# EAGLE design vela (EAGLE 7.1.0)
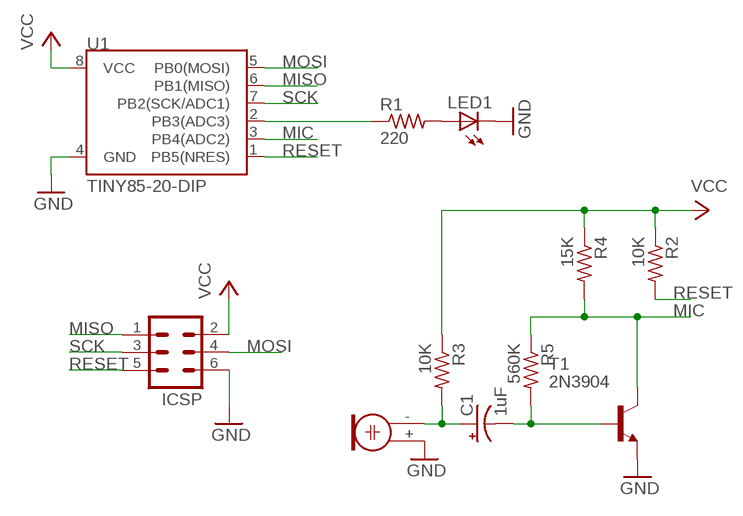
[diagram p0: schematic, sheet 1]

## Parts
C1  1uF  CPOL-USE2-5  [E2-5]
ICSP  MA03-2  [MA03-2]
LED1  LED5MM  [LED5MM]
M1  ELECTRET_MICROPHON-TOM-1545P-R  [TOM-1545P-R]
R1  220  R-US_0207/2V  [0207/2V]
R2  10K  R-US_0207/2V  [0207/2V]
R3  10K  R-US_0207/2V  [0207/2V]
R4  15K  R-US_0207/2V  [0207/2V]
R5  560K  R-US_0207/2V  [0207/2V]
T1  2N3904  [TO92]
U1  TINY85-20-DIP  ATTINY45TINY85-20-DIP  [DIP08]

## Nets
GND: ICSP.6 LED1.K(C) M1.+ T1.3(E) U1.4(GND)
MIC: R4.2 R5.1 T1.1(C) U1.3(PB4(ADC2))
MISO: ICSP.1 U1.6(PB1(MISO))
MOSI: ICSP.4 U1.5(PB0(MOSI))
N$1: LED1.A R1.2
N$2: C1.+ M1.- R3.2
N$3: C1.- R5.2 T1.2(B)
N$4: R1.1 U1.2(PB3(ADC3))
RESET: ICSP.5 R2.2 U1.1(PB5(NRES))
SCK: ICSP.3 U1.7(PB2(SCK/ADC1))
VCC: ICSP.2 R2.1 R3.1 R4.1 U1.8(VCC)

## Library data of the parts
C1 = rcl:CPOL-US: POLARIZED CAPACITOR, American symbol
ICSP = con-lstb:MA03-2: PIN HEADER; OC_FARNELL: unknown; OC_NEWARK: unknown
LED1 = led:LED: LED OSRAM: - CHIPLED LG R971, LG N971, LY N971, LG Q971, LY Q971, LO R971, LY R971 LH N974, LH R974 LS Q976, LO Q976, LY Q976 LO Q996 - Hyper CHIPLED LW Q18S LB Q993, LB Q99A, LB R99A - SideLED LS A670, LO A670, LY A670, LG A670, LP A670 LB A673, LV A673, LT A673, LW A673 LH A674 LY A675 LS A676, LA A676, LO A676, LY A676, LW A676 LS A679, LY A679, LG A679 - Hyper Micro SIDELED® LS Y876, LA Y876, LO Y876, LY Y876 LT Y87S - SmartLED LW L88C, LW L88S LB L89C, LB L89S, LG L890 LS L89K, LO L89K, LY L89K LS L896, LA L896, LO L896, LY L896 - TOPLED LS T670, LO T670, LY T670, LG T670, LP T670 LSG T670, LSP T670, LSY T670, LOP T670, LYG T670 LG T671, LOG T671, LSG T671 LB T673, LV T673, LT T673, LW T673 LH T674 LS T676, LA T676, LO T676, LY T676, LB T676, LH T676, LSB T676, LW T676 LB T67C, LV T67C, LT T67C, LS T67K, LO T67K, LY T67K, LW E67C LS E67B, LA E67B, LO E67B, LY E67B, LB E67C, LV E67C, LT E67C LW T67C LS T679, LY T679, LG T679 LS T770, LO T770, LY T770, LG T770, LP T770 LB T773, LV T773, LT T773, LW T773 LH T774 LS E675, LA E675, LY E675, LS T675 LS T776, LA T776, LO T776, LY T776, LB T776 LHGB T686 LT T68C, LB T68C - Hyper Mini TOPLED® LB M676 - Mini TOPLED Santana® LG M470 LS M47K, LO M47K, LY M47K Source: http://www.osram.convergy.de LUXEON: - LUMILED® LXK2-PW12-R00, LXK2-PW12-S00, LXK2-PW14-U00, LXK2-PW14-V00 LXK2-PM12-R00, LXK2-PM12-S00, LXK2-PM14-U00 LXK2-PE12-Q00, LXK2-PE12-R00, LXK2-PE12-S00, LXK2-PE14-T00, LXK2-PE14-U00 LXK2-PB12-K00, LXK2-PB12-L00, LXK2-PB12-M00, LXK2-PB14-N00, LXK2-PB14-P00, LXK2-PB14-Q00 LXK2-PR12-L00, LXK2-PR12-M00, LXK2-PR14-Q00, LXK2-PR14-R00 LXK2-PD12-Q00, LXK2-PD12-R00, LXK2-PD12-S00 LXK2-PH12-R00, LXK2-PH12-S00 LXK2-PL12-P00, LXK2-PL12-Q00, LXK2-PL12-R00 Source: www.luxeon.com KINGBRIGHT: KA-3528ASYC Source: www.kingbright.com
M1 = microphon:ELECTRET_MICROPHON-: Electret Condenser Microphone
R1-R5 = rcl:R-US_: RESISTOR, American symbol
T1 = transistor:2N3904: NPN TRANSISTOR
U1 = SparkFun-DigitalIC:ATTINY45: Atmel 8-pin 2/4/8kB flash uC; PROD_ID: IC-09445

## Board
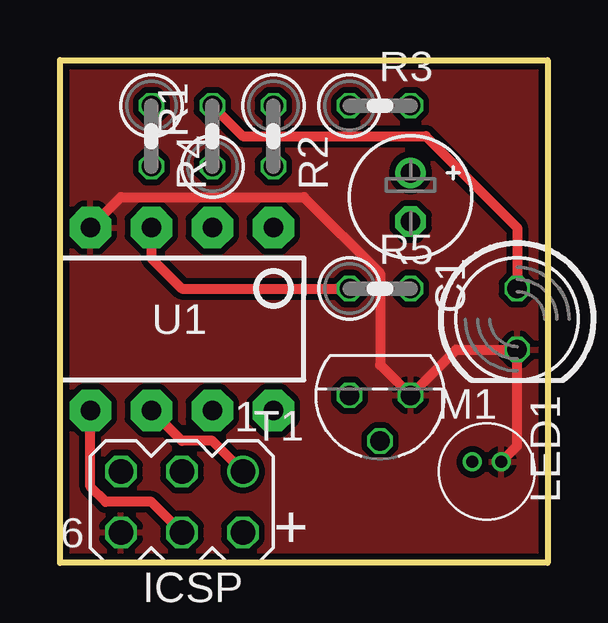
[diagram p1: board, top side]
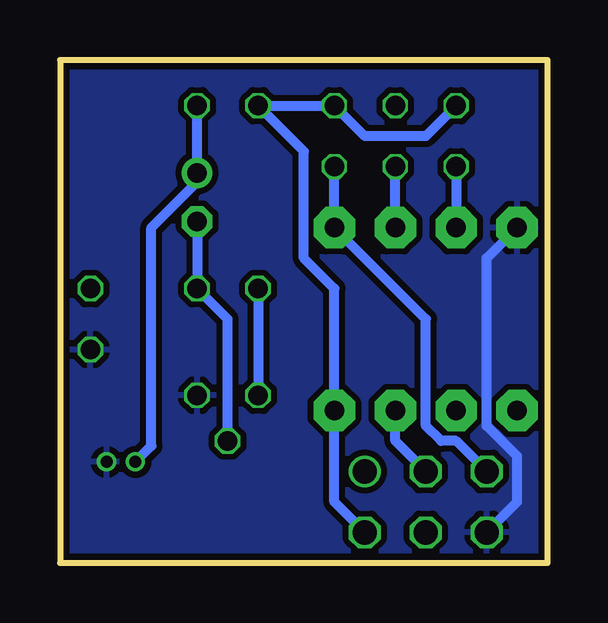
[diagram p2: board, bottom side, seen from below]

Size 20.32 x 20.95 mm. Coordinates in mm from the lower left corner, seen from the top.
Outline: 0,0 0,20.95 20.32,20.95 20.32,0 0,0
Copper layers (1*16): Top 0.035mm / dielectric 1.5mm / Bottom 0.035mm
Design rules "SparkFun *": minimum track width 8mil, minimum drill 20mil, track to track 8mil, track to pad 8mil, pad to pad 8mil, via to via 8mil, smd to smd 8mil, copper to edge 8mil, drill to drill 8mil, minimum pad ring 0mil, minimum via ring 10mil, stop-mask expansion 4mil, vias tented up to drill 20mil, thermal gap 10mil

### Footprints (pad centres in the part's own frame; a part is rotated, then mirrored left to right if it is on the bottom)
E2-5 = drill 0.813 pad 1.27: + -1.016,0 | drill 0.813 pad 1.27 octagon: - 1.016,0
MA03-2 = drill 1.016: 1 -2.54,-1.27 | drill 1.016 octagon: 2 -2.54,1.27; 3 0,-1.27; 4 0,1.27; 5 2.54,-1.27; 6 2.54,1.27
LED5MM = drill 0.813 octagon: A -1.27,0; K 1.27,0
TOM-1545P-R = drill 0.5 pad 0.8: + 0.6,0.4; - -0.6,0.4
0207/2V = drill 0.813 octagon: 1 -1.27,0; 2 1.27,0
TO92 = drill 0.813 octagon: 1 1.27,0; 2 0,1.905; 3 -1.27,0
DIP08 = drill 0.813 pad 1.727 octagon: 1 -3.81,-3.81; 2 -1.27,-3.81; 3 1.27,-3.81; 4 3.81,-3.81; 5 3.81,3.81; 6 1.27,3.81; 7 -1.27,3.81; 8 -3.81,3.81

### Placement (x,y rotation side)
C1  14.61,15.24 270 top
ICSP  5.08,2.54 180 top
LED1  19.05,10.16 270 top
M1  17.78,3.81 0 top
R1  6.35,17.78 90 top
R2  8.89,17.78 270 top
R3  13.34,19.05 0 top
R4  3.81,17.78 270 top
R5  13.34,11.43 0 top
T1  13.34,6.98 180 top
U1  5.08,10.16 180 top

### Tracks (layer width: path | path; a pad name or v marks a point on that pad's centre or on a via)
GND
  Top 0.406: M1.+ 19.05,4.88 LED1.K 16.51,8.89 T1.3 13.34,8.26 13.34,12.06 10.16,15.24 2.54,15.24 U1.4
  Bottom 0.406: ICSP.6 1.27,2.54 1.27,4.44 2.54,5.71 2.54,12.7 U1.4
  pour Bottom (isolate 0.254): 0,20.95 20.32,20.95 20.32,0 0,0
  pour Top (isolate 0.254): 0,20.95 20.32,20.95 20.32,0 0,0
MIC
  Top 0.406: U1.3 3.81,12.7 5.08,11.43 R5.1
  Bottom 0.406: R4.2 U1.3 | R5.1 T1.1
MISO
  Top 0.406: ICSP.1 6.35,5.08 5.08,5.08 U1.6
MOSI
  Top 0.406: ICSP.4 3.81,2.54 1.91,2.54 1.27,3.17 U1.5
N$1
  Top 0.406: R1.2 7.62,17.78 15.24,17.78 19.05,13.97 LED1.A
N$2
  Bottom 0.406: M1.- 16.51,4.88 16.51,13.97 14.22,16.26 C1.+ R3.2
N$3
  Bottom 0.406: C1.- R5.2 13.34,10.16 T1.2
N$4
  Bottom 0.406: U1.2 R1.1
RESET
  Bottom 0.406: ICSP.5 3.81,5.08 4.45,5.08 5.08,5.71 5.08,10.16 U1.1 R2.2
SCK
  Bottom 0.406: ICSP.3 6.35,5.08 U1.7
VCC
  Bottom 0.406: ICSP.2 8.89,2.54 U1.8 8.89,11.43 10.16,12.7 10.16,17.14 R3.1 R2.1 7.62,17.78 5.08,17.78 R4.1

### Text on the board
tPlace: +